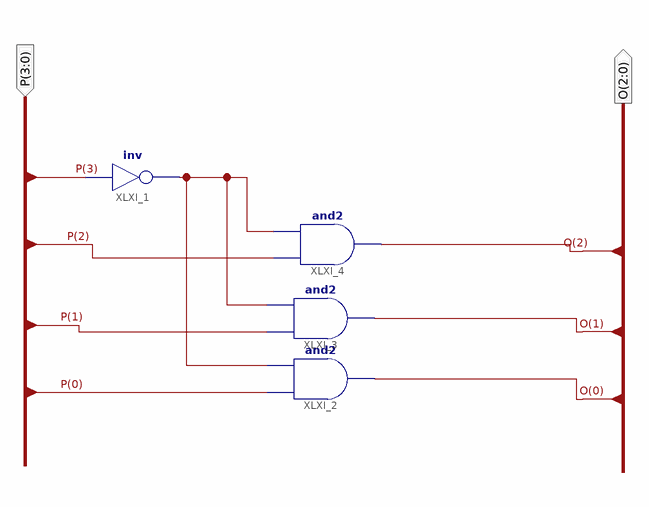
[diagram p0: schematic sheet 1]
// Xilinx ISE schematic demux4to3bit.sch (spartan3e) as structural Verilog: 4 symbols, 2 ports
module demux4to3bit (
  input  [3:0] P,
  output [2:0] O
);

  wire XLXN_10;

  not XLXI_1 (XLXN_10, P[3]);
  and XLXI_2 (O[0], P[0], XLXN_10);
  and XLXI_3 (O[1], P[1], XLXN_10);
  and XLXI_4 (O[2], P[2], XLXN_10);
endmodule
